# EAGLE design TerminalShield (EAGLE 6.5.0)
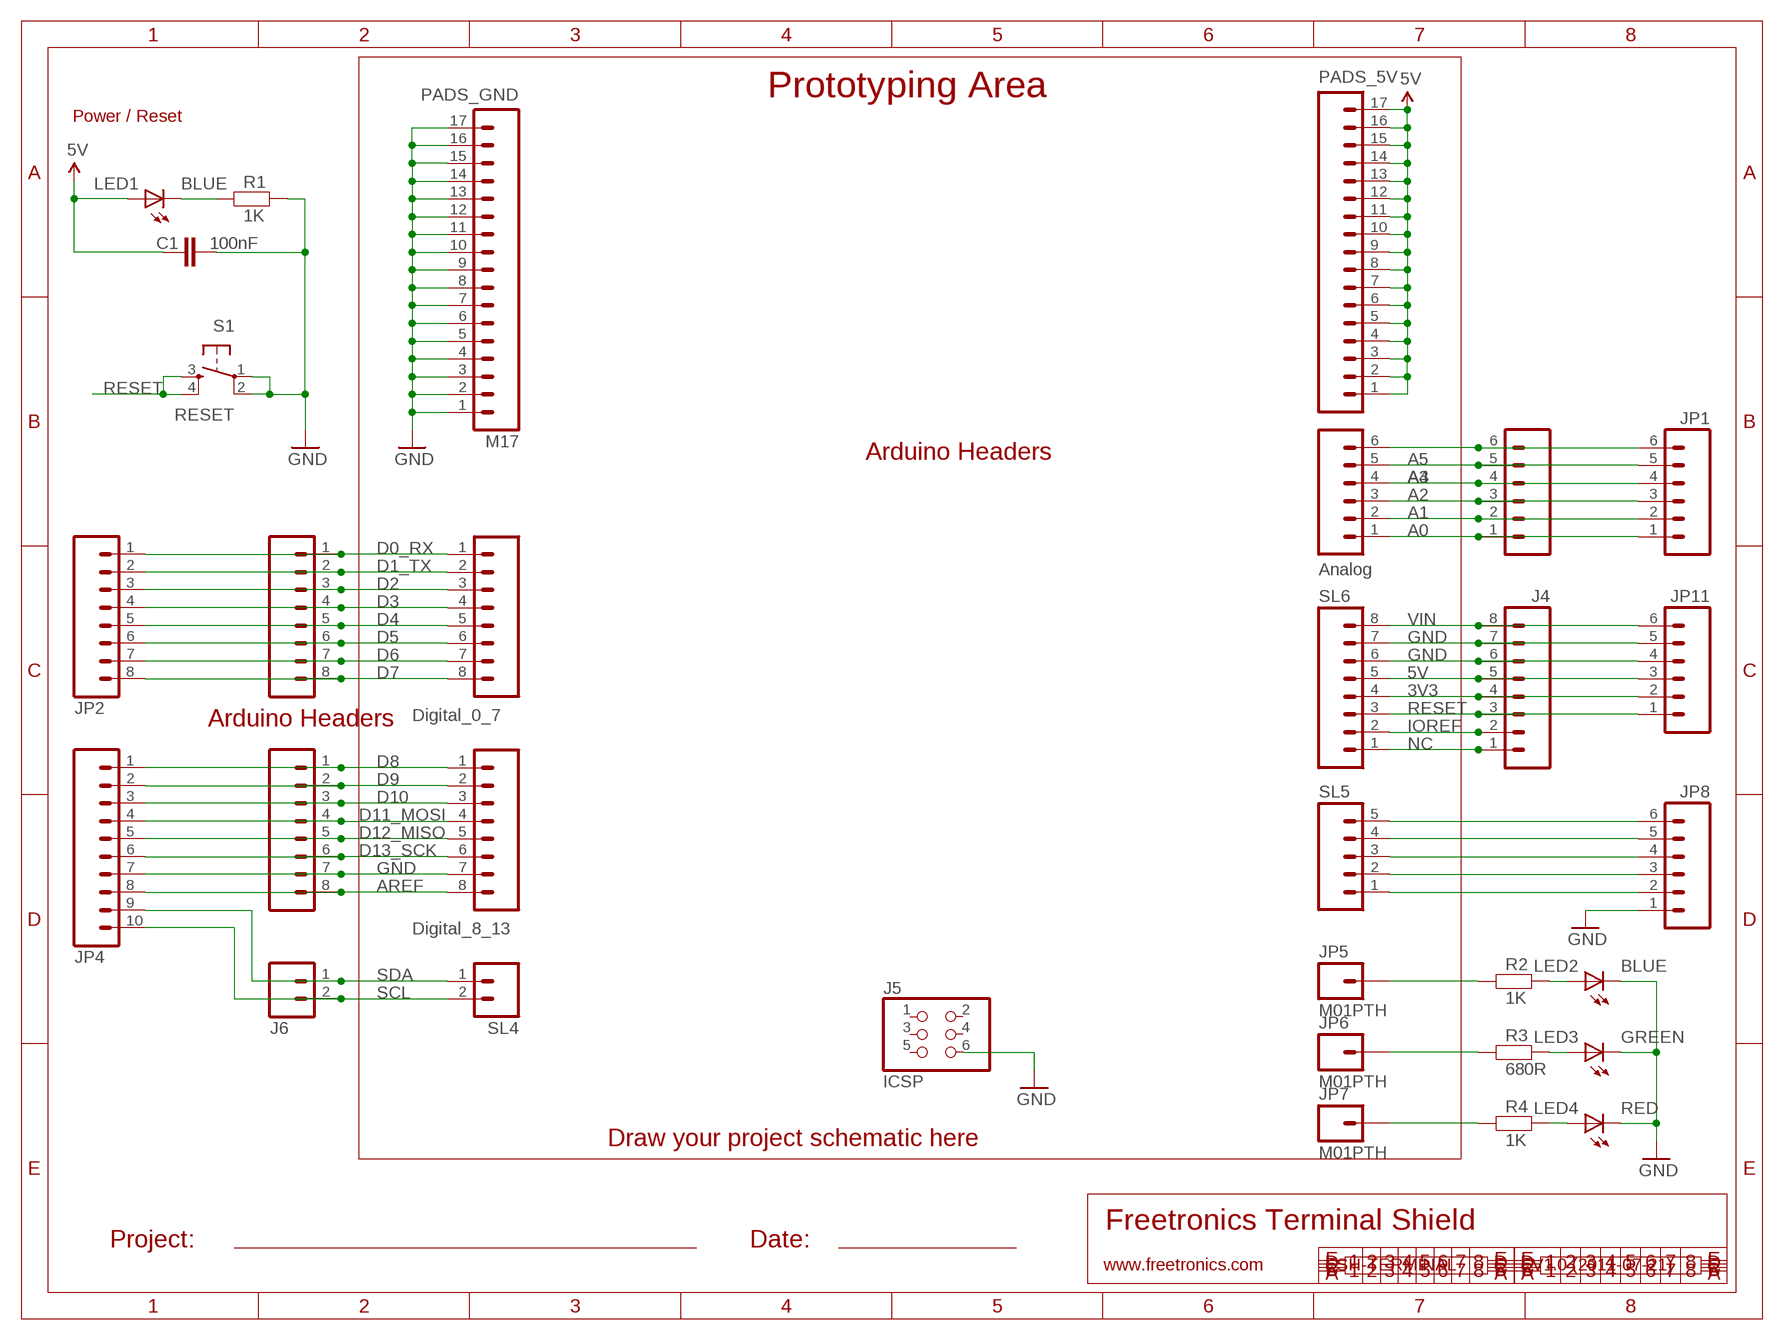
[diagram p0: schematic, sheet 1]

## Parts
C1  100nF  CAP0603  [0603]
J1  Analog  M06SIP  [1X06]
J2  Digital_0_7  M08  [1X08]
J3  Digital_8_13  M08  [1X08]
J4  M08STD  [1X08]
J5  ICSP  PINHD-2X3  [2X03]
J6  M02PTH  [1X02]
JP1  M06  [TERMINALBLOCK_3.5MM_6]
JP2  M08  [TERMINALBLOCK_3.5MM_8]
JP4  M10  [TERMINALBLOCK_3.5MM_10]
JP5  M01PTH  [1X01]
JP6  M01PTH  [1X01]
JP7  M01PTH  [1X01]
JP8  M06  [TERMINALBLOCK_3.5MM_6]
JP11  M06  [TERMINALBLOCK_3.5MM_6]
LED1  BLUE  LED0603  [LED-0603]
LED2  BLUE  LED0603  [LED-0603]
LED3  GREEN  LED0603  [LED-0603]
LED4  RED  LED0603  [LED-0603]
PADS_5V  M17  [1X17]
PADS_GND  M17  [1X17]
R1  1K  RESISTOR0603  [0603]
R2  1K  RESISTOR0603  [0603]
R3  680R  RESISTOR0603  [0603]
R4  1K  RESISTOR0603  [0603]
S1  RESET  TAC_SWITCHSMD  [TACTILE_SWITCH_SMD]
SL1  Analog  M06SIP  [1X06]
SL2  Digital_0_7  M08  [1X08]
SL3  Digital_8_13  M08  [1X08]
SL4  M02PTH  [1X02]
SL5  M05PTH  [1X05]
SL6  M08STD  [1X08]

## Nets
3V3: J4.4 JP11.2 SL6.4
5V: C1.1 J4.5 JP11.3 LED1.A PADS_5V.1 PADS_5V.2 PADS_5V.3 PADS_5V.4 PADS_5V.5 PADS_5V.6 PADS_5V.7 PADS_5V.8 PADS_5V.9 PADS_5V.10 PADS_5V.11 PADS_5V.12 PADS_5V.13 PADS_5V.14 PADS_5V.15 PADS_5V.16 PADS_5V.17 SL6.5
A0: J1.1 JP1.1 SL1.1
A1: J1.2 JP1.2 SL1.2
A2: J1.3 JP1.3 SL1.3
A3: J1.4 JP1.4 SL1.4
A4: J1.5 JP1.5 SL1.5
A5: J1.6 JP1.6 SL1.6
AREF: J3.8 JP4.8 SL3.8
D0_RX: J2.1 JP2.1 SL2.1
D1_TX: J2.2 JP2.2 SL2.2
D2: J2.3 JP2.3 SL2.3
D3: J2.4 JP2.4 SL2.4
D4: J2.5 JP2.5 SL2.5
D5: J2.6 JP2.6 SL2.6
D6: J2.7 JP2.7 SL2.7
D7: J2.8 JP2.8 SL2.8
D8: J3.1 JP4.1 SL3.1
D9: J3.2 JP4.2 SL3.2
D10: J3.3 JP4.3 SL3.3
D11_MOSI: J3.4 JP4.4 SL3.4
D12_MISO: J3.5 JP4.5 SL3.5
D13_SCK: J3.6 JP4.6 SL3.6
GND: C1.2 J3.7 J4.6 J4.7 J5.6 JP4.7 JP8.1 JP11.4 JP11.5 LED2.C LED3.C LED4.C PADS_GND.1 PADS_GND.2 PADS_GND.3 PADS_GND.4 PADS_GND.5 PADS_GND.6 PADS_GND.7 PADS_GND.8 PADS_GND.9 PADS_GND.10 PADS_GND.11 PADS_GND.12 PADS_GND.13 PADS_GND.14 PADS_GND.15 PADS_GND.16 PADS_GND.17 R1.2 S1.1 S1.2 SL3.7 SL6.6 SL6.7
IOREF: J4.2 SL6.2
N$2: LED4.A R4.2
N$3: LED3.A R3.2
N$4: JP6.1 R3.1
N$6: LED2.A R2.2
N$18: JP8.2 SL5.1
N$19: JP8.3 SL5.2
N$20: JP8.4 SL5.3
N$21: JP8.5 SL5.4
N$34: JP8.6 SL5.5
N$248: LED1.C R1.1
N$249: JP5.1 R2.1
NC: J4.1 SL6.1
PADS_GND: JP7.1 R4.1
RESET: J4.3 JP11.1 S1.3 S1.4 SL6.3
SCL: J6.2 JP4.10 SL4.2
SDA: J6.1 JP4.9 SL4.1
VIN: J4.8 JP11.6 SL6.8
Unconnected: J5.1 J5.2 J5.3 J5.4 J5.5

## Notes on the sheet
- Prototyping Area
- Power / Reset
- Arduino Headers
- Arduino Headers
- Draw your project schematic here
- Freetronics Terminal Shield
- Project: | Date:
- www.freetronics.com | SH-TERMINAL | V1.0 (2011-07-21)

## Library data of the parts
C1 = freetronics:CAP: Capacitor Standard 0603 ceramic capacitor, and 0.1" leaded capacitor.
J1 JP8 JP11 SL1 = freetronics:M06: Header 6 Standard 6-pin 0.1" header. Use with straight break away headers (SKU : PRT-00116), right angle break away headers (PRT-00553), swiss pins (PRT-00743), machine pins (PRT-00117), and female headers (PRT-00115). Molex polarized connector foot print use with SKU : PRT-08094 with associated crimp pins and housings. NOTES ON THE VARIANTS LOCK and LOCK_LONGPADS... This footprint was designed to help hold the alignment of a through-hole component (i.e. 6-pin header) while soldering it into place. You may notice that each hole has been shifted either up or down by 0.005 of an inch from it's more standard position (which is a perfectly straight line). This slight alteration caused the pins (the squares in the middle) to touch the edges of the holes. Because they are alternating, it causes a "brace" to hold the component in place. 0.005 has proven to be the perfect amount of "off-center" position when using our standard breakaway headers. Although looks a little odd when you look at the bare footprint, once you have a header in there, the alteration is very hard to notice. Also, if you push a header all the way into place, it is covered up entirely on the bottom side. This idea of altering the position of holes to aid alignment will be further integrated into the Sparkfun Library for other footprints. It can help hold any component with 3 or more connection pins.
J2 J3 SL2 SL3 = freetronics:M08: Header 8 Standard 8-pin 0.1" header. Use with straight break away headers (SKU : PRT-00116), right angle break away headers (PRT-00553), swiss pins (PRT-00743), machine pins (PRT-00117), and female headers (PRT-00115).
J4 JP2 SL6 = freetronics-master-v1:M08: Header 8 Standard 8-pin 0.1" header. Use with straight break away headers (SKU : PRT-00116), right angle break away headers (PRT-00553), swiss pins (PRT-00743), machine pins (PRT-00117), and female headers (PRT-00115).
J5 = freetronics-master-v1:PINHD-2X3: PIN HEADER
J6 SL4 = freetronics-master-v1.1:M02: Header 2 Standard 2-pin 0.1" header. Use with straight break away headers (SKU : PRT-00116), right angle break away headers (PRT-00553), swiss pins (PRT-00743), machine pins (PRT-00117), and female headers (PRT-00115). Molex polarized connector foot print use with SKU : PRT-08233 with associated crimp pins and housings.
JP1 = freetronics-master-v1:M06: Header 6 Standard 6-pin 0.1" header. Use with straight break away headers (SKU : PRT-00116), right angle break away headers (PRT-00553), swiss pins (PRT-00743), machine pins (PRT-00117), and female headers (PRT-00115). Molex polarized connector foot print use with SKU : PRT-08094 with associated crimp pins and housings. NOTES ON THE VARIANTS LOCK and LOCK_LONGPADS... This footprint was designed to help hold the alignment of a through-hole component (i.e. 6-pin header) while soldering it into place. You may notice that each hole has been shifted either up or down by 0.005 of an inch from it's more standard position (which is a perfectly straight line). This slight alteration caused the pins (the squares in the middle) to touch the edges of the holes. Because they are alternating, it causes a "brace" to hold the component in place. 0.005 has proven to be the perfect amount of "off-center" position when using our standard breakaway headers. Although looks a little odd when you look at the bare footprint, once you have a header in there, the alteration is very hard to notice. Also, if you push a header all the way into place, it is covered up entirely on the bottom side. This idea of altering the position of holes to aid alignment will be further integrated into the Sparkfun Library for other footprints. It can help hold any component with 3 or more connection pins.
JP4 = freetronics-master-v1.1:M10
JP5-JP7 = freetronics-master-v1:M01: Header 1 Standard 1-pin 0.1" header. Use with straight break away headers (SKU : PRT-00116), right angle break away headers (PRT-00553), swiss pins (PRT-00743), machine pins (PRT-00117), and female headers (PRT-00115).
LED1-LED4 = freetronics:LED: LEDs Standard schematic elements and footprints for 5mm, 3mm, 1206, and 0603 sized LEDs. 5mm - Spark Fun Electronics SKU : COM-00529 (and others)
PADS_5V = freetronics-master-v1:M17
PADS_GND = freetronics-master-v1.1:M17
R1-R4 = freetronics:RESISTOR: Resistor Basic schematic elements and footprints for 0603, 1206, and PTH 1/10th watt (small) resistors.
S1 = freetronics:TAC_SWITCH: Momentary Switch Button commonly used for reset or general input. Spark Fun Electronics SKU : COM-00097
SL5 = freetronics-master-v1.1:M05: Header 5 Standard 5-pin 0.1" header. Use with straight break away headers (SKU : PRT-00116), right angle break away headers (PRT-00553), swiss pins (PRT-00743), machine pins (PRT-00117), and female headers (PRT-00115). Molex polarized connector foot print use with SKU : PRT-08230 with associated crimp pins and housings.

## Board
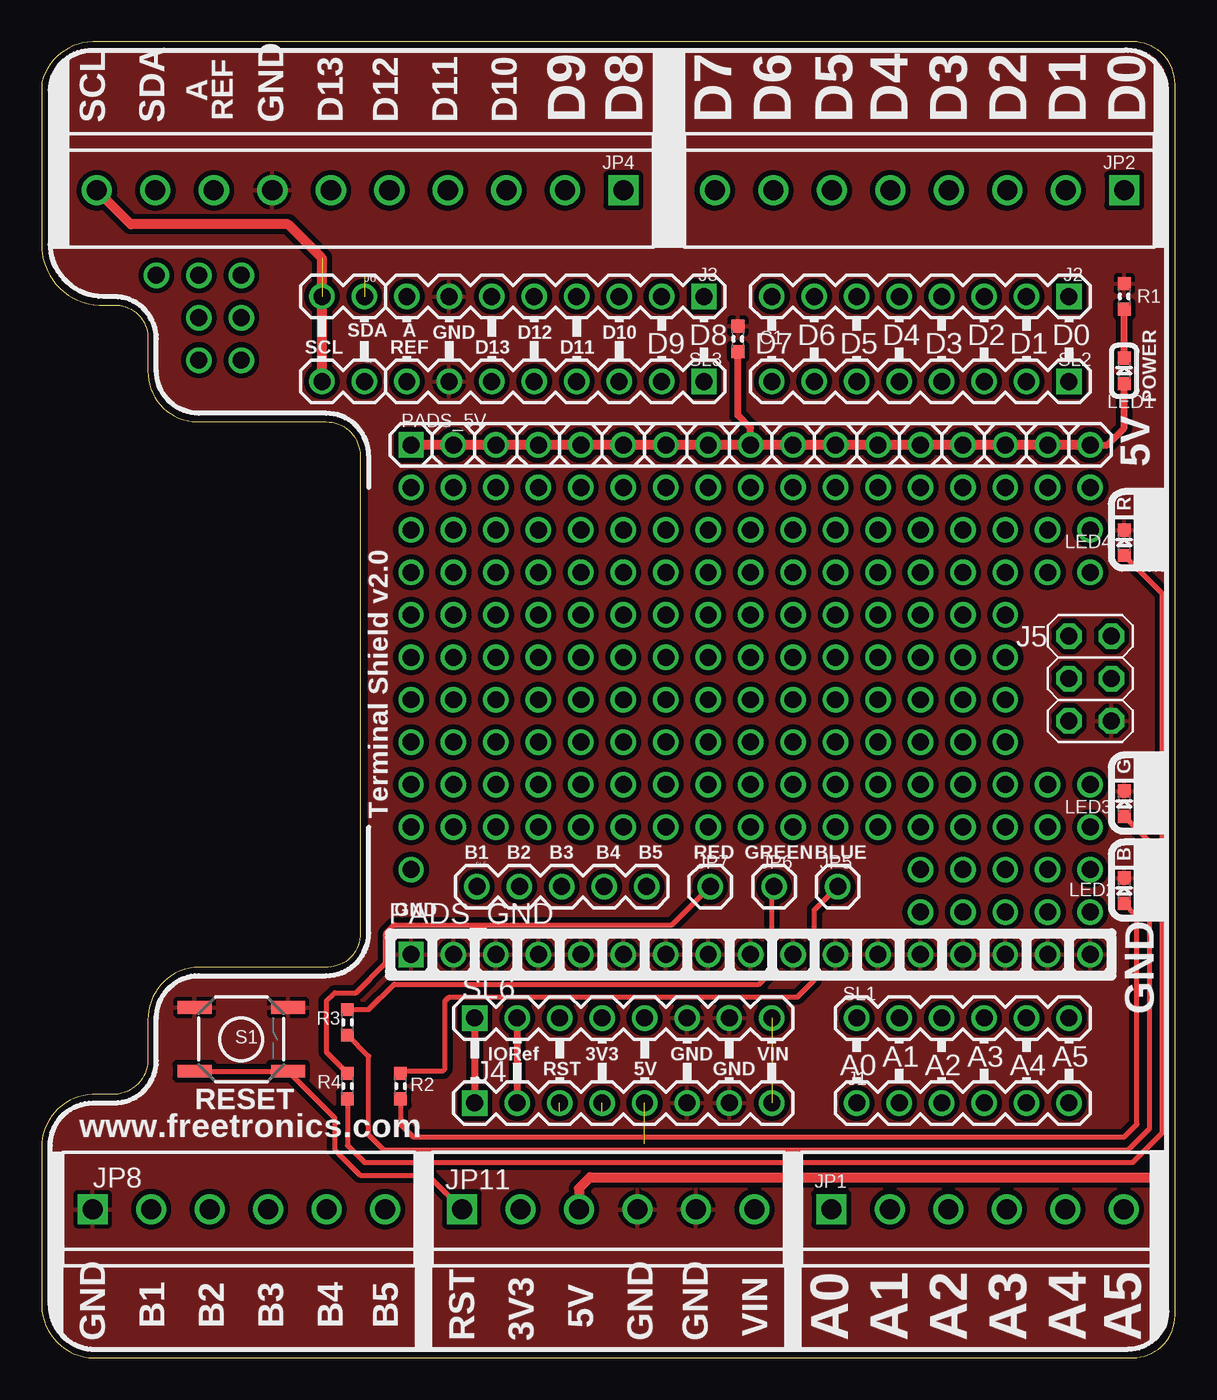
[diagram p1: board, top side]
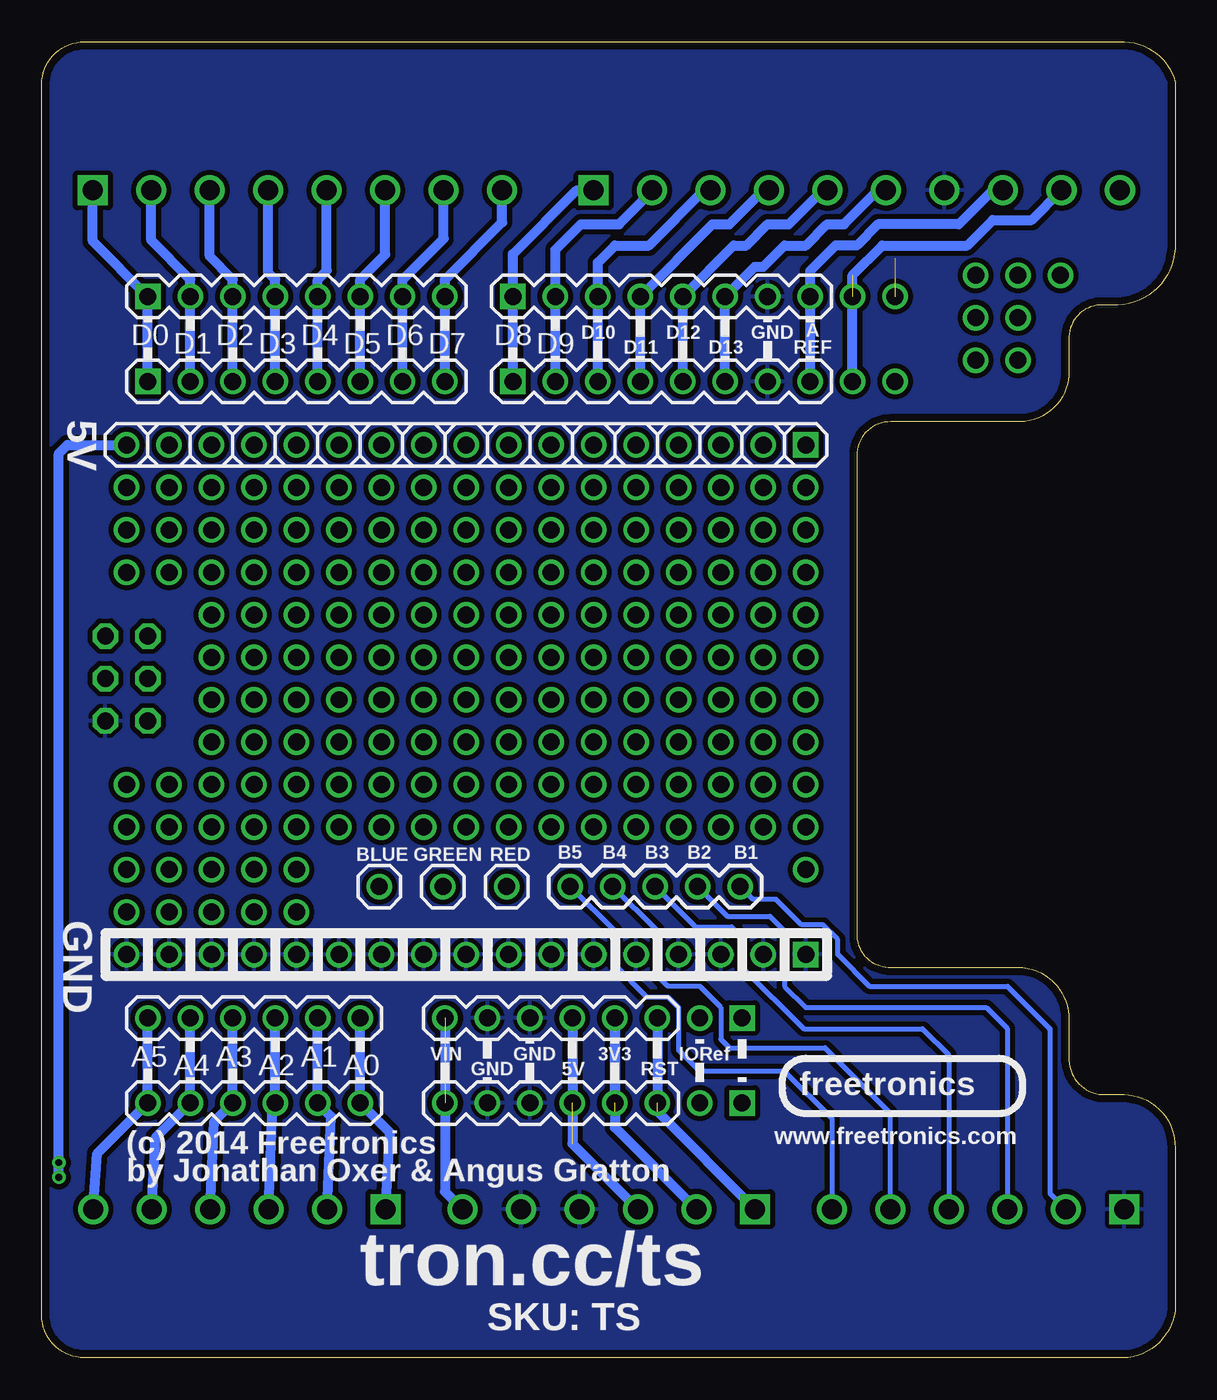
[diagram p2: board, bottom side, seen from below]

Size 67.82 x 78.74 mm. Coordinates in mm from the lower left corner, seen from the top.
Outline: 0,2.79 arc74 2.79,0 65.28,0 arc90 67.82,2.54 67.82,76.2 arc90 65.28,78.74 3.05,78.74 arc74 0,76.33 0,66.67 arc90 3.43,62.99 4.32,62.99 arc-90 6.35,61.09 6.35,59.05 arc90 9.27,56.01 17.02,56.01 arc-90 19.05,53.98 19.05,25.4 arc-90 17.15,23.37 9.4,23.37 arc90 6.35,20.19 6.35,17.78 arc-90 4.19,15.75 3.05,15.75 arc90 0,12.57 0,2.79
Copper layers (1*16): Top 0.035mm / dielectric 1.5mm / Bottom 0.035mm
Design rules "default *": minimum track width 8mil, minimum drill 15mil, track to track 12mil, track to pad 12mil, pad to pad 12mil, via to via 12mil, smd to smd 8mil, copper to edge 18mil, drill to drill 8mil, minimum pad ring 10mil, minimum via ring 8mil, stop-mask expansion 4mil, vias tented up to drill 25mil, thermal gap 10mil

### Footprints (pad centres in the part's own frame; a part is rotated, then mirrored left to right if it is on the bottom)
0603 = smd 0.762 x 0.762: 1 -0.762,0; 2 0.762,0
1X06 = drill 1.016: 1 0,0; 2 2.54,0; 3 5.08,0; 4 7.62,0; 5 10.16,0; 6 12.7,0
1X08 = drill 1.016 square: 1 0,0 | drill 1.016: 2 2.54,0; 3 5.08,0; 4 7.62,0; 5 10.16,0; 6 12.7,0; 7 15.24,0; 8 17.78,0
2X03 = drill 1.016 octagon: 1 -2.54,-1.27; 2 -2.54,1.27; 3 0,-1.27; 4 0,1.27; 5 2.54,-1.27; 6 2.54,1.27
1X02 = drill 1.016: 1 0,0; 2 2.54,0
TERMINALBLOCK_3.5MM_6 = drill 1.2 square: 1 0,0 | drill 1.2: 2 3.5,0; 3 7,0; 4 10.5,0; 5 14,0; 6 17.5,0
TERMINALBLOCK_3.5MM_8 = drill 1.2 square: 1 0,0 | drill 1.2: 2 3.5,0; 3 7,0; 4 10.5,0; 5 14,0; 6 17.5,0; 7 21,0; 8 24.5,0
TERMINALBLOCK_3.5MM_10 = drill 1.2 square: 1 0,0 | drill 1.2: 2 3.5,0; 3 7,0; 4 10.5,0; 5 14,0; 6 17.5,0; 7 21,0; 8 24.5,0; 9 28,0; 10 31.5,0
1X01 = drill 1.016: 1 0,0
LED-0603 = smd 0.762 x 0.762: A -0.762,0; C 0.762,0
1X17 = drill 1.016 square: 1 0,0 | drill 1.016: 2 2.54,0; 3 5.08,0; 4 7.62,0; 5 10.16,0; 6 12.7,0; 7 15.24,0; 8 17.78,0; 9 20.32,0; 10 22.86,0; 11 25.4,0; 12 27.94,0; 13 30.48,0; 14 33.02,0; 15 35.56,0; 16 38.1,0; 17 40.64,0
TACTILE_SWITCH_SMD = smd 2.032 x 0.762: 1 -2.794,1.905; 2 2.794,1.905; 3 -2.794,-1.905; 4 2.794,-1.905
1X05 = drill 1.016: 1 0,0; 2 2.54,0; 3 5.08,0; 4 7.62,0; 5 10.16,0

### Placement (x,y rotation side)
C1  41.66,60.96 90 top
J1  48.77,15.24 0 top
J2  61.47,63.5 180 top
J3  39.62,63.5 180 top
J4  25.91,15.24 0 top
J5  62.74,40.64 270 top
J6  19.3,63.5 180 top
JP1  47.24,8.89 0 top
JP2  64.77,69.85 180 top
JP4  34.8,69.85 180 top
JP5  47.62,28.19 270 top
JP6  43.82,28.19 270 top
JP7  40.01,28.19 270 top
JP8  3.05,8.89 0 top
JP11  25.15,8.89 0 top
LED1  64.77,59.05 90 top
LED2  64.77,27.94 90 top
LED3  64.77,33.15 90 top
LED4  64.77,48.77 90 top
PADS_5V  22.1,54.61 0 top
PADS_GND  22.1,24.13 0 top
R1  64.77,63.5 90 top
R2  21.46,16.26 270 top
R3  18.29,20.07 270 top
R4  18.29,16.26 270 top
S1  11.94,19.05 0 top
SL1  48.77,20.32 0 top
SL2  61.47,58.42 180 top
SL3  39.62,58.42 180 top
SL4  19.3,58.42 180 top
SL5  26.04,28.19 0 top
SL6  25.91,20.32 0 top

### Tracks (layer width: path | path; a pad name or v marks a point on that pad's centre or on a via)
3V3  (1 unrouted)
  Bottom 0.61: 33.53,14.73 SL6.4 33.53,13.77 JP11.2
5V  (via drill 0.4)  (1 unrouted)
  Top 0.406: C1.1 41.66,56.39 42.42,55.63 PADS_5V.9 | LED1.A 64.77,55.63 63.75,54.61 PADS_5V.17
  Top 0.61: v66.8,11.68 v66.8,10.79 32.81,10.79 32.15,10.13 JP11.3 | PADS_5V.17 PADS_5V.16 PADS_5V.15 PADS_5V.14 PADS_5V.13 PADS_5V.12 PADS_5V.11 PADS_5V.10 PADS_5V.9 PADS_5V.8 PADS_5V.7 PADS_5V.6 PADS_5V.5 PADS_5V.4 PADS_5V.3 PADS_5V.2 PADS_5V.1
  Bottom 0.61: PADS_5V.17 66.29,54.61 66.8,54.1 v66.8,11.68 v66.8,10.79 | SL6.5 36.07,12.81 JP11.3
A0
  Bottom 0.61: SL1.1 J1.1 46.99,13.46 JP1.1
A1
  Bottom 0.61: SL1.2 J1.2 50.49,14.42 JP1.2
A2
  Bottom 0.61: SL1.3 J1.3 53.99,15.1 JP1.3
A3
  Bottom 0.61: SL1.4 J1.4 57.49,14.14 JP1.4
A4
  Bottom 0.61: SL1.5 J1.5 60.99,13.18 JP1.5
A5
  Bottom 0.61: SL1.6 J1.6 64.49,12.22 JP1.6
AREF
  Bottom 0.61: SL3.8 J3.8 21.84,65.02 20.32,66.55 19.05,66.55 17.78,67.82 12.95,67.82 10.92,69.85 JP4.8
D0_RX
  Bottom 0.61: SL2.1 J2.1 64.77,66.8 JP2.1
D1_TX
  Bottom 0.61: SL2.2 J2.2 58.93,64.52 61.27,66.86 JP2.2
D2
  Bottom 0.61: SL2.3 J2.3 56.39,64.52 57.77,65.9 JP2.3
D3
  Bottom 0.61: SL2.4 J2.4 53.85,64.52 54.27,64.94 JP2.4
D4
  Bottom 0.61: SL2.5 J2.5 51.31,64.52 50.77,65.05 JP2.5
D5
  Bottom 0.61: SL2.6 J2.6 48.77,64.52 47.27,66.01 JP2.6
D6
  Bottom 0.61: SL2.7 J2.7 46.23,64.52 43.77,66.97 JP2.7
D7
  Bottom 0.61: SL2.8 J2.8 43.69,64.52 40.27,67.93 JP2.8
D8
  Bottom 0.61: SL3.1 J3.1 39.62,66.04 35.81,69.85 JP4.1
D9
  Bottom 0.61: SL3.2 J3.2 37.08,66.29 35.56,67.82 33.27,67.82 31.3,69.79 JP4.2
D10
  Bottom 0.61: SL3.3 J3.3 34.54,65.53 33.53,66.55 31.5,66.55 28.19,69.85 JP4.3
D11_MOSI
  Bottom 0.61: SL3.4 J3.4 27.69,67.82 26.67,67.82 24.64,69.85 JP4.4
D12_MISO
  Bottom 0.61: SL3.5 J3.5 26.42,66.55 25.65,66.55 24.38,67.82 23.11,67.82 21.08,69.85 JP4.5
D13_SCK
  Bottom 0.61: SL3.6 J3.6 25.15,65.28 24.64,65.28 23.37,66.55 22.1,66.55 20.83,67.82 19.81,67.82 17.78,69.85 JP4.6
GND
  pour Bottom: -0.13,76.2 arc-74 3.05,78.74 65.28,78.74 arc-74 67.82,76.2 67.82,2.54 arc-74 65.28,0 2.41,0 arc-74 -0.13,2.54
  pour Top: -0.13,76.2 arc-74 3.05,78.74 65.28,78.74 arc-74 67.82,76.2 67.82,2.54 arc-74 65.28,0 2.41,0 arc-74 -0.13,2.54
IOREF
  Top 0.406: SL6.2 J4.2
N$2
  Top 0.305: R4.2 18.29,12.7 19.3,11.68 65.28,11.68 67.06,13.46 67.06,45.72 LED4.A
N$3
  Top 0.305: R3.2 19.56,18.03 19.56,13.34 20.45,12.45 65.02,12.45 66.29,13.72 66.29,30.86 LED3.A
N$4
  Top 0.305: R3.1 19.56,20.83 21.08,22.35 42.93,22.35 43.69,23.11 43.69,28.07 JP6.1
N$5  (via drill 1.02)
  other vias: 57.66,26.67
N$6
  Top 0.305: LED2.A 65.53,26.42 65.53,13.97 64.77,13.21 22.23,13.21 21.46,13.97 R2.2
N$7  (via drill 1.02)
  other vias: 55.12,26.67
N$8  (via drill 1.02)
  other vias: 52.58,26.67
N$9  (via drill 1.02)
  other vias: 22.1,29.21
N$18
  Bottom 0.305: JP8.2 7.49,9.84 7.49,19.68 10.03,22.23 18.29,22.23 20.19,24.13 20.19,25.02 21.08,25.91 22.35,25.91 23.88,27.43 25.27,27.43 SL5.1
N$19
  Bottom 0.305: SL5.2 26.8,26.42 24.23,26.42 23.37,25.55 23.37,22.23 22.1,20.95 11.3,20.95 10.05,19.7 JP8.3
N$20
  Bottom 0.305: SL5.3 28.7,25.78 26.54,25.78 25.91,25.15 25.91,23.37 22.23,19.68 15.11,19.68 13.55,18.12 JP8.4
N$21
  Bottom 0.305: JP8.5 17.05,14.63 20.95,18.54 26.67,18.54 27.18,19.05 27.18,20.95 28.45,22.23 30.35,22.23 30.99,22.86 30.99,25.53 SL5.4
N$22  (via drill 1.02)
  other vias: 57.66,29.21
N$23  (via drill 1.02)
  other vias: 55.12,29.21
N$24  (via drill 1.02)
  other vias: 52.58,29.21
N$34
  Bottom 0.305: SL5.5 33.53,25.53 33.53,23.5 31.62,21.59 30.35,21.59 29.72,20.95 29.72,18.41 28.45,17.14 23.37,17.14 20.55,14.32 JP8.6
N$38  (via drill 1.02)
  other vias: 57.66,31.75
N$39  (via drill 1.02)
  other vias: 55.12,31.75
N$40  (via drill 1.02)
  other vias: 52.58,31.75
N$41  (via drill 1.02)
  other vias: 50.04,31.75
N$42  (via drill 1.02)
  other vias: 47.5,31.75
N$43  (via drill 1.02)
  other vias: 44.96,31.75
N$44  (via drill 1.02)
  other vias: 42.42,31.75
N$45  (via drill 1.02)
  other vias: 39.88,31.75
N$46  (via drill 1.02)
  other vias: 37.34,31.75
N$47  (via drill 1.02)
  other vias: 34.8,31.75
N$48  (via drill 1.02)
  other vias: 32.26,31.75
N$49  (via drill 1.02)
  other vias: 29.72,31.75
N$50  (via drill 1.02)
  other vias: 27.18,31.75
N$51  (via drill 1.02)
  other vias: 24.64,31.75
N$52  (via drill 1.02)
  other vias: 22.1,31.75
N$54  (via drill 1.02)
  other vias: 57.66,34.29
N$55  (via drill 1.02)
  other vias: 55.12,34.29
N$56  (via drill 1.02)
  other vias: 52.58,34.29
N$57  (via drill 1.02)
  other vias: 50.04,34.29
N$58  (via drill 1.02)
  other vias: 47.5,34.29
N$59  (via drill 1.02)
  other vias: 44.96,34.29
N$60  (via drill 1.02)
  other vias: 42.42,34.29
N$61  (via drill 1.02)
  other vias: 39.88,34.29
N$62  (via drill 1.02)
  other vias: 37.34,34.29
N$63  (via drill 1.02)
  other vias: 34.8,34.29
N$64  (via drill 1.02)
  other vias: 32.26,34.29
N$65  (via drill 1.02)
  other vias: 29.72,34.29
N$66  (via drill 1.02)
  other vias: 27.18,34.29
N$67  (via drill 1.02)
  other vias: 24.64,34.29
N$68  (via drill 1.02)
  other vias: 22.1,34.29
N$70  (via drill 1.02)
  other vias: 57.66,36.83
N$71  (via drill 1.02)
  other vias: 55.12,36.83
N$72  (via drill 1.02)
  other vias: 52.58,36.83
N$73  (via drill 1.02)
  other vias: 50.04,36.83
N$74  (via drill 1.02)
  other vias: 47.5,36.83
N$75  (via drill 1.02)
  other vias: 44.96,36.83
N$76  (via drill 1.02)
  other vias: 42.42,36.83
N$77  (via drill 1.02)
  other vias: 39.88,36.83
N$78  (via drill 1.02)
  other vias: 37.34,36.83
N$79  (via drill 1.02)
  other vias: 34.8,36.83
N$80  (via drill 1.02)
  other vias: 32.26,36.83
N$81  (via drill 1.02)
  other vias: 29.72,36.83
N$82  (via drill 1.02)
  other vias: 27.18,36.83
N$83  (via drill 1.02)
  other vias: 24.64,36.83
N$84  (via drill 1.02)
  other vias: 22.1,36.83
N$86  (via drill 1.02)
  other vias: 57.66,39.37
N$87  (via drill 1.02)
  other vias: 55.12,39.37
N$88  (via drill 1.02)
  other vias: 52.58,39.37
N$89  (via drill 1.02)
  other vias: 50.04,39.37
N$90  (via drill 1.02)
  other vias: 47.5,39.37
N$91  (via drill 1.02)
  other vias: 44.96,39.37
N$92  (via drill 1.02)
  other vias: 42.42,39.37
N$93  (via drill 1.02)
  other vias: 39.88,39.37
N$94  (via drill 1.02)
  other vias: 37.34,39.37
N$95  (via drill 1.02)
  other vias: 34.8,39.37
N$96  (via drill 1.02)
  other vias: 32.26,39.37
N$97  (via drill 1.02)
  other vias: 29.72,39.37
N$98  (via drill 1.02)
  other vias: 27.18,39.37
N$99  (via drill 1.02)
  other vias: 24.64,39.37
N$100  (via drill 1.02)
  other vias: 22.1,39.37
N$102  (via drill 1.02)
  other vias: 57.66,41.91
N$103  (via drill 1.02)
  other vias: 55.12,41.91
N$104  (via drill 1.02)
  other vias: 52.58,41.91
N$105  (via drill 1.02)
  other vias: 50.04,41.91
N$106  (via drill 1.02)
  other vias: 47.5,41.91
N$107  (via drill 1.02)
  other vias: 44.96,41.91
N$108  (via drill 1.02)
  other vias: 42.42,41.91
N$109  (via drill 1.02)
  other vias: 39.88,41.91
N$110  (via drill 1.02)
  other vias: 37.34,41.91
N$111  (via drill 1.02)
  other vias: 34.8,41.91
N$112  (via drill 1.02)
  other vias: 32.26,41.91
N$113  (via drill 1.02)
  other vias: 29.72,41.91
N$114  (via drill 1.02)
  other vias: 27.18,41.91
N$115  (via drill 1.02)
  other vias: 24.64,41.91
N$116  (via drill 1.02)
  other vias: 22.1,41.91
N$118  (via drill 1.02)
  other vias: 57.66,44.45
N$119  (via drill 1.02)
  other vias: 55.12,44.45
N$120  (via drill 1.02)
  other vias: 52.58,44.45
N$121  (via drill 1.02)
  other vias: 50.04,44.45
N$122  (via drill 1.02)
  other vias: 47.5,44.45
N$123  (via drill 1.02)
  other vias: 44.96,44.45
N$124  (via drill 1.02)
  other vias: 42.42,44.45
N$125  (via drill 1.02)
  other vias: 39.88,44.45
N$126  (via drill 1.02)
  other vias: 37.34,44.45
N$127  (via drill 1.02)
  other vias: 34.8,44.45
N$128  (via drill 1.02)
  other vias: 32.26,44.45
N$129  (via drill 1.02)
  other vias: 29.72,44.45
N$130  (via drill 1.02)
  other vias: 27.18,44.45
N$131  (via drill 1.02)
  other vias: 24.64,44.45
N$132  (via drill 1.02)
  other vias: 22.1,44.45
N$134  (via drill 1.02)
  other vias: 57.66,46.99
N$135  (via drill 1.02)
  other vias: 55.12,46.99
N$136  (via drill 1.02)
  other vias: 52.58,46.99
N$137  (via drill 1.02)
  other vias: 50.04,46.99
N$138  (via drill 1.02)
  other vias: 47.5,46.99
N$139  (via drill 1.02)
  other vias: 44.96,46.99
N$140  (via drill 1.02)
  other vias: 42.42,46.99
N$141  (via drill 1.02)
  other vias: 39.88,46.99
N$142  (via drill 1.02)
  other vias: 37.34,46.99
N$143  (via drill 1.02)
  other vias: 34.8,46.99
N$144  (via drill 1.02)
  other vias: 32.26,46.99
N$145  (via drill 1.02)
  other vias: 29.72,46.99
N$146  (via drill 1.02)
  other vias: 27.18,46.99
N$147  (via drill 1.02)
  other vias: 24.64,46.99
N$148  (via drill 1.02)
  other vias: 22.1,46.99
N$150  (via drill 1.02)
  other vias: 57.66,49.53
N$151  (via drill 1.02)
  other vias: 55.12,49.53
N$152  (via drill 1.02)
  other vias: 52.58,49.53
N$153  (via drill 1.02)
  other vias: 50.04,49.53
N$154  (via drill 1.02)
  other vias: 47.5,49.53
N$155  (via drill 1.02)
  other vias: 44.96,49.53
N$156  (via drill 1.02)
  other vias: 42.42,49.53
N$157  (via drill 1.02)
  other vias: 39.88,49.53
N$158  (via drill 1.02)
  other vias: 37.34,49.53
N$159  (via drill 1.02)
  other vias: 34.8,49.53
N$160  (via drill 1.02)
  other vias: 32.26,49.53
N$161  (via drill 1.02)
  other vias: 29.72,49.53
N$162  (via drill 1.02)
  other vias: 27.18,49.53
N$163  (via drill 1.02)
  other vias: 24.64,49.53
N$164  (via drill 1.02)
  other vias: 22.1,49.53
N$166  (via drill 1.02)
  other vias: 57.66,52.07
N$167  (via drill 1.02)
  other vias: 55.12,52.07
N$168  (via drill 1.02)
  other vias: 52.58,52.07
N$169  (via drill 1.02)
  other vias: 50.04,52.07
N$170  (via drill 1.02)
  other vias: 47.5,52.07
N$171  (via drill 1.02)
  other vias: 44.96,52.07
N$172  (via drill 1.02)
  other vias: 42.42,52.07
N$173  (via drill 1.02)
  other vias: 39.88,52.07
N$174  (via drill 1.02)
  other vias: 37.34,52.07
N$175  (via drill 1.02)
  other vias: 34.8,52.07
N$176  (via drill 1.02)
  other vias: 32.26,52.07
N$177  (via drill 1.02)
  other vias: 29.72,52.07
N$178  (via drill 1.02)
  other vias: 27.18,52.07
N$179  (via drill 1.02)
  other vias: 24.64,52.07
N$180  (via drill 1.02)
  other vias: 22.1,52.07
N$182  (via drill 1.02)
  other vias: 60.2,26.67
N$183  (via drill 1.02)
  other vias: 60.2,29.21
N$184  (via drill 1.02)
  other vias: 60.2,31.75
N$185  (via drill 1.02)
  other vias: 60.2,34.29
N$190  (via drill 1.02)
  other vias: 60.2,46.99
N$191  (via drill 1.02)
  other vias: 60.2,49.53
N$192  (via drill 1.02)
  other vias: 62.74,52.07
N$193  (via drill 1.02)
  other vias: 62.74,26.67
N$194  (via drill 1.02)
  other vias: 62.74,29.21
N$195  (via drill 1.02)
  other vias: 62.74,31.75
N$196  (via drill 1.02)
  other vias: 62.74,34.29
N$201  (via drill 1.02)
  other vias: 62.74,46.99
N$202  (via drill 1.02)
  other vias: 62.74,49.53
N$203  (via drill 1.02)
  other vias: 60.2,52.07
N$248
  Top 0.406: LED1.C R1.1
N$249
  Top 0.305: JP5.1 46.23,26.8 46.23,22.61 45.21,21.59 24.38,21.59 24.13,21.34 24.13,17.27 24,17.14 21.59,17.14 R2.1
N$256  (via drill 1.02)
  other vias: 11.94,59.69
N$257  (via drill 1.02)
  other vias: 11.94,62.23
N$258  (via drill 1.02)
  other vias: 11.94,64.77
N$259  (via drill 1.02)
  other vias: 9.4,59.69
N$260  (via drill 1.02)
  other vias: 9.4,62.23
N$261  (via drill 1.02)
  other vias: 9.4,64.77
N$262  (via drill 1.02)
  other vias: 6.86,64.77
NC
  Top 0.406: SL6.1 J4.1
PADS_GND
  Top 0.305: R4.1 17.02,18.29 17.02,21.34 17.53,21.84 18.8,21.84 20.57,23.62 20.57,25.4 21.08,25.91 37.72,25.91 JP7.1
RESET  (1 unrouted)
  Top 0.305: S1.3 S1.4 17.53,14.35 17.53,12.45 19.05,10.92 23.11,10.92 JP11.1
  Bottom 0.61: SL6.3 30.99,14.73 JP11.1
SCL  (1 unrouted)
  Top 0.61: SL4.2 16.76,65.79 14.73,67.82 5.33,67.82 JP4.10
SDA  (1 unrouted)
  Bottom 0.61: SL4.1 19.3,64.77 17.53,66.55 12.45,66.55 10.92,68.07 8.58,68.07 JP4.9
VIN  (1 unrouted)
  Bottom 0.61: SL6.8 43.69,9.93 JP11.6

### Text on the board
tPlace: A | SCL | SDA | REF | GND | D13 | D12 | D11 | D10 | D9 | D8 | D7 | D6 | D5 | D4 | D3 | D2 | D1 | D0 | SDA | A | GND | D12 | D10 | D8 | D6 | D4 | D2 | D0 | SCL | REF | D13 | D11 | D9 | D7 | D5 | D3 | D1 | POWER | 5V | R | G | Terminal Shield v2.0 | B1 | B2 | B3 | B4 | B5 | RED | GREEN | BLUE | B | GND | GND | IORef | 3V3 | GND | VIN | RST | 5V | GND | A0 | A1 | A2 | A3 | A4 | A5 | RESET | www.freetronics.com | B1 | B2 | B3 | B4 | B5 | 5V | GND | RST | 3V3 | GND | GND | VIN | A0 | A1 | A2 | A3 | A4 | A5
bPlace: A | GND | D12 | D10 | D8 | D6 | D4 | D2 | D0 | REF | D13 | D11 | D9 | D7 | D5 | D3 | D1 | 5V | B1 | B2 | B3 | B4 | B5 | RED | GREEN | BLUE | GND | IORef | 3V3 | GND | VIN | RST | 5V | GND | A0 | A1 | A2 | A3 | A4 | A5 | freetronics | www.freetronics.com | (c) 2014 Freetronics | by Jonathan Oxer & Angus Gratton | tron.cc/ts | SKU: TS